# Altium schematic sheet ROV2019V2.0.SchDoc
size A3
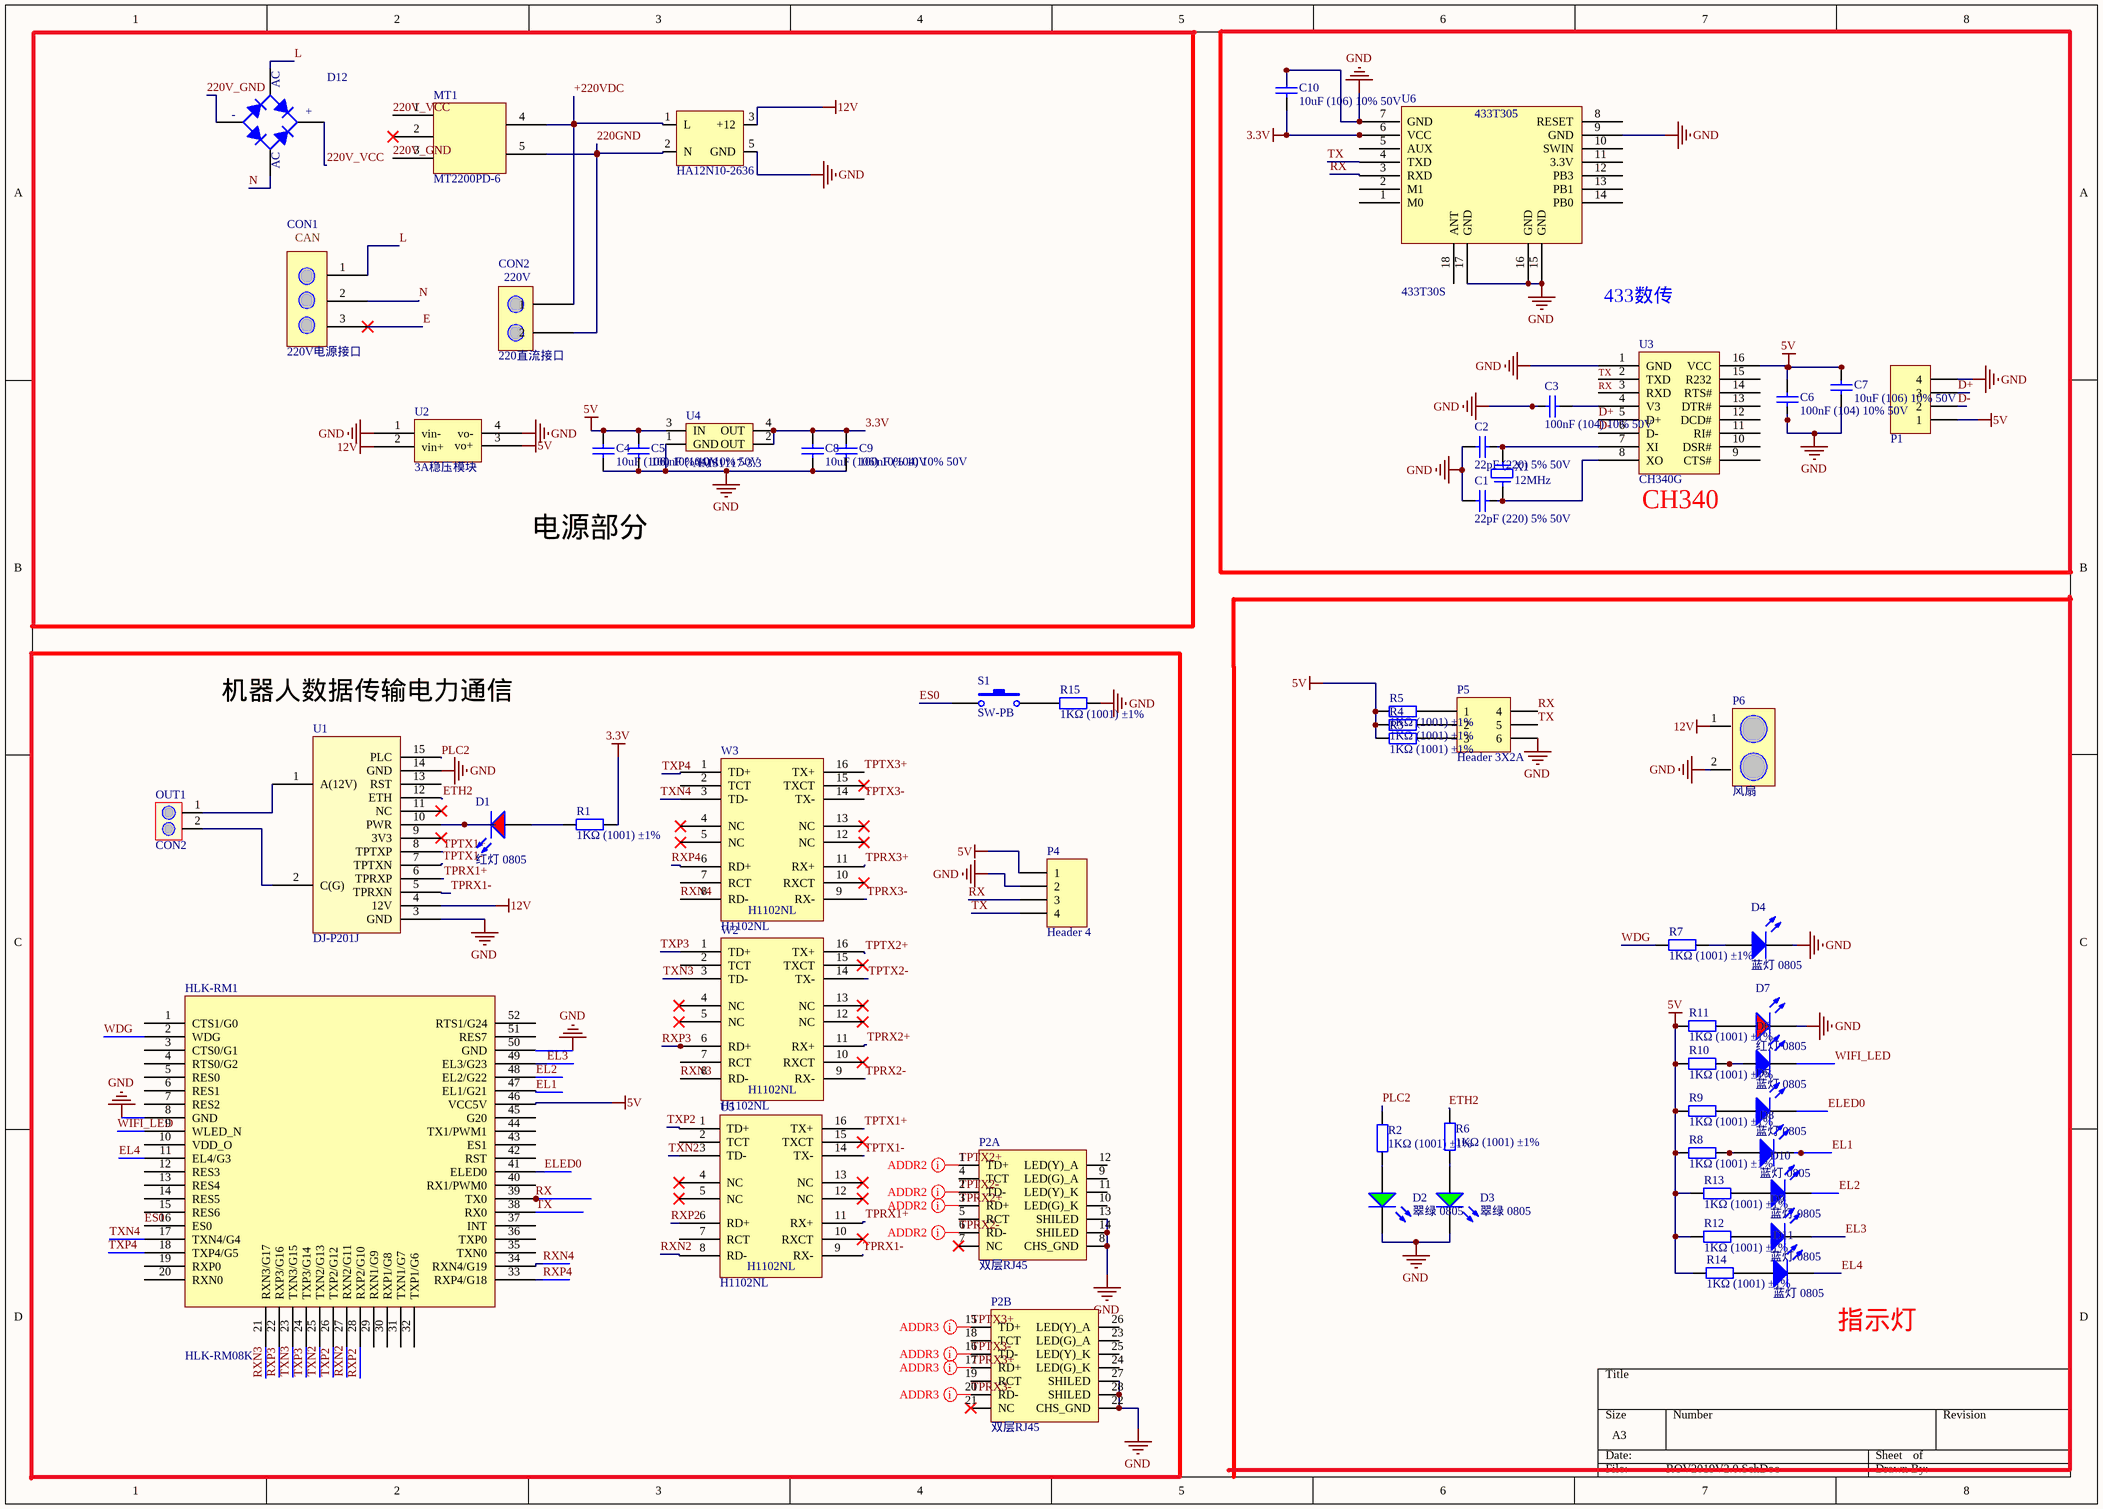
[diagram p0: ROV2019V2.0.SchDoc]

## Parts
?  HA12N10-2636  [HA12N10-2636]
C1  22pF (220) 5% 50V  [LC-0603_C]
C2  22pF (220) 5% 50V  [LC-0603_C]
C3  100nF (104) 10% 50V  [LC-0603_C]
C4  10uF (106) 10% 10V  [0603_C]
C5  100nF (104) 10% 50V  [0603_C]
C6  100nF (104) 10% 50V  [LC-0603_C]
C7  10uF (106) 10% 50V  [LC-1206_C]
C8  10uF (106) 10% 10V  [0603_C]
C9  100nF (104) 10% 50V  [0603_C]
C10  10uF (106) 10% 50V  [LC-1206_C]
CON1  220V电源接口  [220V接口]
CON2  220直流接口  [220V直接口]
D1  红灯 0805  [LC-0805_LED_S1]
D2  翠绿 0805  [0805_LED_S1]
D3  翠绿 0805  [0805_LED_S1]
D4  蓝灯 0805  [0805_LED_S1]
D5  蓝灯 0805  [0805_LED_S1]
D6  蓝灯 0805  [0805_LED_S1]
D7  红灯 0805  [LC-0805_LED_S1]
D8  蓝灯 0805  [0805_LED_S1]
D9  蓝灯 0805  [0805_LED_S1]
D10  蓝灯 0805  [0805_LED_S1]
D11  蓝灯 0805  [0805_LED_S1]
D12  整流桥  [整流桥]  (value not drawn)
HLK-RM1  HLK-RM08K  [RM08k]
MT1  MT2200PD-6  [MT2200PD-6]
OUT1  CON2  [电力猫接口]
P1  Header 4  [USB_B]  (value not drawn)
P2  双层RJ45  [双层RJ45]  (parts A,B of 2)
P4  Header 4  [Molex-4]
P5  Header 3X2A  [HDR2X3_CEN]
P6  风扇  [风扇接口]
R1  1KΩ (1001) ±1%  [LC-0603_R]
R2  1KΩ (1001) ±1%  [LC-0603_R]
R3  1KΩ (1001) ±1%  [0603_R]
R4  1KΩ (1001) ±1%  [0603_R]
R5  1KΩ (1001) ±1%  [0603_R]
R6  1KΩ (1001) ±1%  [LC-0603_R]
R7  1KΩ (1001) ±1%  [LC-0603_R]
R8  1KΩ (1001) ±1%  [LC-0603_R]
R9  1KΩ (1001) ±1%  [LC-0603_R]
R10  1KΩ (1001) ±1%  [LC-0603_R]
R11  1KΩ (1001) ±1%  [LC-0603_R]
R12  1KΩ (1001) ±1%  [LC-0603_R]
R13  1KΩ (1001) ±1%  [LC-0603_R]
R14  1KΩ (1001) ±1%  [LC-0603_R]
R15  1KΩ (1001) ±1%  [LC-0603_R]
S1  SW-PB  [SW_PB2_A1]
U1  DJ-P201J  [DJ-P201J]
U2  3A稳压模块  [稳压模块]
U3  CH340G  [SOP16M]
U4  AMS1117-3.3  [AN1117]
U5  H1102NL  [H1102NL]
U6  433T30S  [433]
W2  H1102NL  [H1102NL]
W3  H1102NL  [H1102NL]
X1  12MHz  [XTAL2]

## Nets
3.3V: C8.2 C9.2 C10.1 R1.2 U4.2(OUT) U4.4(OUT) U6.6(VCC)
5V: C4.2 C5.2 C6.1 C7.2 HLK-RM1.46(VCC5V) P1.1 P4.1 R3.1 R4.1 R5.1 R8.1 R9.1 R10.1 R11.1 R12.1 R13.1 R14.1 U2.3(vo+) U3.16(VCC) U4.3(IN)
12V: ?.3(+12) P6.1 U1.4(12V) U2.2(vin+)
GND: ?.5(GND) C1.1 C2.1 C3.2 C4.1 C5.1 C6.2 C7.1 C8.1 C9.1 C10.2 D2.K D3.K D4.K D7.K HLK-RM1.8(GND) HLK-RM1.50(GND) P1.4 P2.8(CHS_GND) P2.13(SHILED) P2.14(SHILED) P2.22(CHS_GND) P2.27(SHILED) P2.28(SHILED) P4.2 P5.6 P6.2 R15.2 U1.3(GND) U1.14(GND) U2.1(vin-) U2.4(vo-) U3.1(GND) U4.1(GND) U6.7(GND) U6.9(GND) U6.15(GND) U6.16(GND) U6.17(GND)
220GND: ?.2(N) CON2.2 MT1.5
220V_GND: D12.4(A) MT1.3
220V_VCC: D12.1(K) MT1.1
+220VDC: ?.1(L) CON2.1 MT1.4
D+: P1.3 U3.5(D+)
D-: P1.2 U3.6(D-)
E: CON1.3
EL1: D8.K HLK-RM1.47(EL1/G21)
EL2: D10.K HLK-RM1.48(EL2/G22)
EL3: D9.K HLK-RM1.49(EL3/G23)
EL4: D11.K HLK-RM1.11(EL4/G3)
ELED0: D5.K HLK-RM1.41(ELED0)
ES0: HLK-RM1.16(ES0) S1.1
ETH2: R6.2 U1.12(ETH)
L: CON1.1 D12.2(C)
N: CON1.2 D12.3(AC)
PLC2: R2.2 U1.15(PLC)
RX: HLK-RM1.39(TX0) P4.3 P5.4 U3.3(RXD) U6.3(RXD)
RXN2: HLK-RM1.27(RXN2/G11) U5.8(RD-)
RXN3: HLK-RM1.21(RXN3/G17) W2.8(RD-)
RXN4: HLK-RM1.34(RXN4/G19) W3.8(RD-)
RXP2: HLK-RM1.28(RXP2/G10) U5.6(RD+)
RXP3: HLK-RM1.22(RXP3/G16) W2.6(RD+)
RXP4: HLK-RM1.33(RXP4/G18) W3.6(RD+)
TPRX1+: U1.6(TPRXP) U5.11(RX+)
TPRX1-: U1.5(TPRXN) U5.9(RX-)
TPRX2+: P2.3(RD+) W2.11(RX+)
TPRX2-: P2.6(RD-) W2.9(RX-)
TPRX3+: P2.17(RD+) W3.11(RX+)
TPRX3-: P2.20(RD-) W3.9(RX-)
TPTX1+: U1.8(TPTXP) U5.16(TX+)
TPTX1-: U1.7(TPTXN) U5.14(TX-)
TPTX2+: P2.1(TD+) W2.16(TX+)
TPTX2-: P2.2(TD-) W2.14(TX-)
TPTX3+: P2.15(TD+) W3.16(TX+)
TPTX3-: P2.16(TD-) W3.14(TX-)
TX: HLK-RM1.38(RX0) P4.4 P5.5 U3.2(TXD) U6.4(TXD)
TXN2: HLK-RM1.25(TXN2/G13) U5.3(TD-)
TXN3: HLK-RM1.23(TXN3/G15) W2.3(TD-)
TXN4: HLK-RM1.17(TXN4/G4) W3.3(TD-)
TXP2: HLK-RM1.26(TXP2/G12) U5.1(TD+)
TXP3: HLK-RM1.24(TXP3/G14) W2.1(TD+)
TXP4: HLK-RM1.18(TXP4/G5) W3.1(TD+)
WDG: HLK-RM1.2(WDG) R7.1
WIFI_LED: D6.K HLK-RM1.9(WLED_N)
NetC1_2: C1.2 U3.8(XO) X1.1
NetC2_2: C2.2 U3.7(XI) X1.2
NetC3_1: C3.1 U3.4(V3)
NetD1_A: D1.A R1.1
NetD1_K: D1.K U1.10(PWR)
NetD2_A: D2.A R2.1
NetD3_A: D3.A R6.1
NetD4_A: D4.A R7.2
NetD5_A: D5.A R9.2
NetD6_A: D6.A R10.2
NetD7_A: D7.A R11.2
NetD8_A: D8.A R8.2
NetD9_A: D9.A R12.2
NetD10_A: D10.A R13.2
NetD11_A: D11.A R14.2
NetOUT1_1: OUT1.1 U1.1(A(12V))
NetOUT1_2: OUT1.2 U1.2(C(G))
NetP5_1: P5.1 R5.2
NetP5_2: P5.2 R4.2
NetP5_3: P5.3 R3.2
NetR15_1: R15.1 S1.2

Not connected (* = marked no-connect by the designer): HLK-RM1 1(CTS1/G0) 3(CTS0/G1) 4(RTS0/G2) 5(RES0) 6(RES1) 7(RES2) 10(VDD_O) 12(RES3) 13(RES4) 14(RES5) 15(RES6) 19(RXP0) 20(RXN0) 29(RXN1/G9) 30(RXP1/G8) 31(TXN1/G7) 32(TXP1/G6) 35(TXN0) 36(TXP0) 37(INT) 40(RX1/PWM0) 42(RST) 43(ES1) 44(TX1/PWM1) 45(G20) 51(RES7) 52(RTS1/G24); MT1 2*; P2 4(TCT) 5(RCT) 7(NC)* 9(LED(G)_A) 10(LED(G)_K) 11(LED(Y)_K) 12(LED(Y)_A) 18(TCT) 19(RCT) 21(NC)* 23(LED(G)_A) 24(LED(G)_K) 25(LED(Y)_K) 26(LED(Y)_A); U1 9(3V3)* 11(NC)* 13(RST); U3 9(CTS#) 10(DSR#) 11(RI#) 12(DCD#) 13(DTR#) 14(RTS#) 15(R232); U5 2(TCT) 4(NC)* 5(NC)* 7(RCT) 10(RXCT)* 12(NC)* 13(NC)* 15(TXCT)*; U6 1(M0) 2(M1) 5(AUX) 8(RESET) 10(SWIN) 11(3.3V) 12(PB3) 13(PB1) 14(PB0) 18(ANT); W2 2(TCT) 4(NC) 5(NC) 7(RCT) 10(RXCT) 12(NC) 13(NC) 15(TXCT); W3 2(TCT) 4(NC)* 5(NC)* 7(RCT) 10(RXCT)* 12(NC)* 13(NC)* 15(TXCT)*

## Layout directives
mark named ADDR2: TPRX2+, TPRX2-, TPTX2+, TPTX2-
mark named ADDR3: TPRX3+, TPRX3-, TPTX3+, TPTX3-

## Notes on the sheet
- 433数传
- (near U3) CH340
- 电源部分
- (near U1) 机器人数据传输电力通信
- 指示灯
- (in symbol 220V电源接口) CAN
- (in symbol 220直流接口) 220V
- (in symbol 433T30S) 433T305
- (in symbol 整流桥) -; +

## Library data of the parts
C1 C2 = 0603 22pF (220) 5% 50V: 贴片电容; ComponentLink1Description: 供应商链接; ComponentLink1URL: http://www.szlcsc.com/product/details_2005.html; Package: 0603; Supplier: LC; SuppliersPartNumber: C1653
C3 C5 C6 C9 = 0603 100nF (104) 10% 50V: 贴片电容; ComponentLink1Description: 供应商链接; ComponentLink1URL: http://www.szlcsc.com/product/details_15331.html; Package: 0603; Supplier: LC; SuppliersPartNumber: C14663
C4 C8 = 0603 10uF (106) 10% 10V: 贴片电容; ComponentLink1Description: 供应商链接; ComponentLink1URL: http://www.szlcsc.com/product/details_20411.html; Package: 0603; Supplier: LC; SuppliersPartNumber: C19702
C7 C10 = 1206 10uF (106) 10% 50V: 贴片电容; ComponentLink1Description: 供应商链接; ComponentLink1URL: http://www.szlcsc.com/product/details_14236.html; Package: 1206; Supplier: LC; SuppliersPartNumber: C13585
D1 D7 = 0805 红灯: 发光二极管; ComponentLink1Description: 供应商链接; ComponentLink1URL: http://www.szlcsc.com/product/details_2668.html; Package: 0805; Supplier: LC; SuppliersPartNumber: C2295
D2 D3 = 0805 翠绿: 发光二极管; ComponentLink1Description: 供应商链接; ComponentLink1URL: http://www.szlcsc.com/product/details_2670.html; Package: 0805; Supplier: LC; SuppliersPartNumber: C2297
D4-D6 D8-D11 = 0805 蓝灯: 发光二极管; ComponentLink1Description: 供应商链接; ComponentLink1URL: http://www.szlcsc.com/product/details_2666.html; Package: 0805; Supplier: LC; SuppliersPartNumber: C2293
HLK-RM1 = RM08K: RM08K WIFI MODEL
MT1 = MT2200PD-6: 220V AC DC
P1 = Header 4: 接插件; LatestRevisionDate: 17-Jul-2002; LatestRevisionNote: Re-released for DXP Platform.; Publisher: Altium Limited
P4 = Header 4: Header, 4-Pin; LatestRevisionDate: 17-Jul-2002; LatestRevisionNote: Re-released for DXP Platform.; Publisher: Altium Limited
P5 = Header 3X2A: Header, 3-Pin, Dual row; LatestRevisionDate: 17-Jul-2002; LatestRevisionNote: Re-released for DXP Platform.; Publisher: Altium Limited
R1-R15 = 0603 1KΩ (1001) 1%: 贴片电阻; ComponentLink1Description: 供应商链接; ComponentLink1URL: http://www.szlcsc.com/product/details_21904.html; Package: 0603; Supplier: LC; SuppliersPartNumber: C21190
S1 = SW-PB: 微动开关; Published: 24-Mar-1999; LatestRevisionDate: 17-Jul-2002; LatestRevisionNote: Re-released for DXP Platform.; PackageReference: SPST-2; Publisher: Altium Limited
U1 = DJ-P201J: 电力载波
U2 = 可调稳压芯片
U3 = CH340
U4 = AMS1117
U5 W2 W3 = H1102NL: 网口变压器
X1 = 晶振: XTAL